# EAGLE design Current Driver v2 (EAGLE 9.6.2)
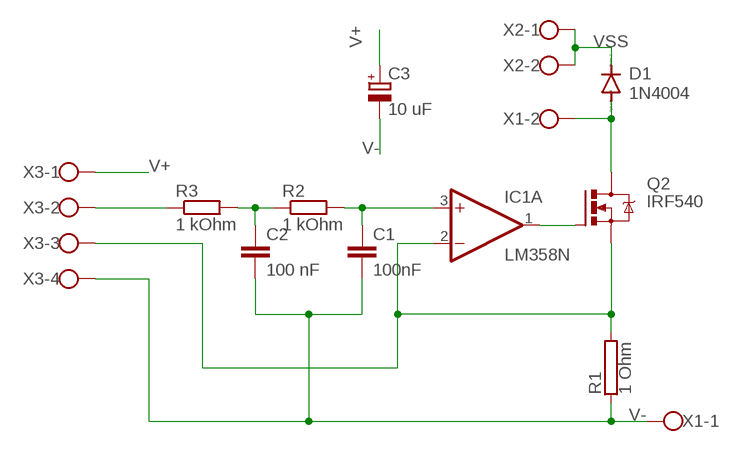
[diagram p0: schematic, sheet 1]

## Parts
C1  100nF  C-EU050-030X075  [C050-030X075]
C2  100 nF  C-EU050-030X075  [C050-030X075]
C3  10 uF  CPOL-EUE2,5-6E  [E2,5-6E]
D1  1N4004  [DO41-10]
IC1  LM358N  [DIL08]
Q2  IRF540  [TO220BV]
R1  1 Ohm  RAC05  [AC05]
R2  1 kOhm  R-EU_0204/7  [0204/7]
R3  1 kOhm  R-EU_0204/7  [0204/7]
X1  W237-102  [W237-102]
X2  W237-102  [W237-102]
X3  W237-4  [W237-4]

## Nets
N$1: IC1.1(A:OUT) Q2.G
N$2: D1.A Q2.D X1.2
N$4: C2.1 R2.1 R3.2
N$5: C1.1 IC1.3(A:+IN) R2.2
N$6: R3.1 X3.2
N$7: IC1.2(A:-IN) Q2.S R1.2 X3.3
V+: C3.+ X3.1
V-: C1.2 C2.2 C3.- R1.1 X1.1 X3.4
VSS: D1.C X2.1 X2.2
Unconnected: IC1.5(B:+IN) IC1.6(B:-IN) IC1.7(B:OUT)

## Power pins joined to a net without a drawn wire
V+: IC1.8(P:V+)
V-: IC1.4(P:V-)

## Library data of the parts
C1 C2 = rcl:C-EU: CAPACITOR, European symbol; SPICEPREFIX: C
C3 = rcl:CPOL-EU: POLARIZED CAPACITOR, European symbol; SPICEPREFIX: C
D1 = diode:1N4004: DIODE general purpose rectifier, 1 A
IC1 = linear:LM358: OP AMP also LM158; LM258; LM2904 Source: http://cache.national.com/ds/LM/LM158.pdf
Q2 = transistor-power:IRF540: HEXFET Power MOSFET
R1 = resistor-power:R: Power Resitor; OC_FARNELL: unknown; OC_NEWARK: unknown
R2 R3 = rcl:R-EU_: RESISTOR, European symbol; SPICEPREFIX: R
X1 X2 = con-wago-500:W237-102: WAGO SCREW CLAMP; MPN: 237-102; OC_FARNELL: unknown; OC_NEWARK: 70K9898
X3 = con-wago-500:W237-4: WAGO SCREW CLAMP; OC_FARNELL: unknown; OC_NEWARK: unknown

## Board
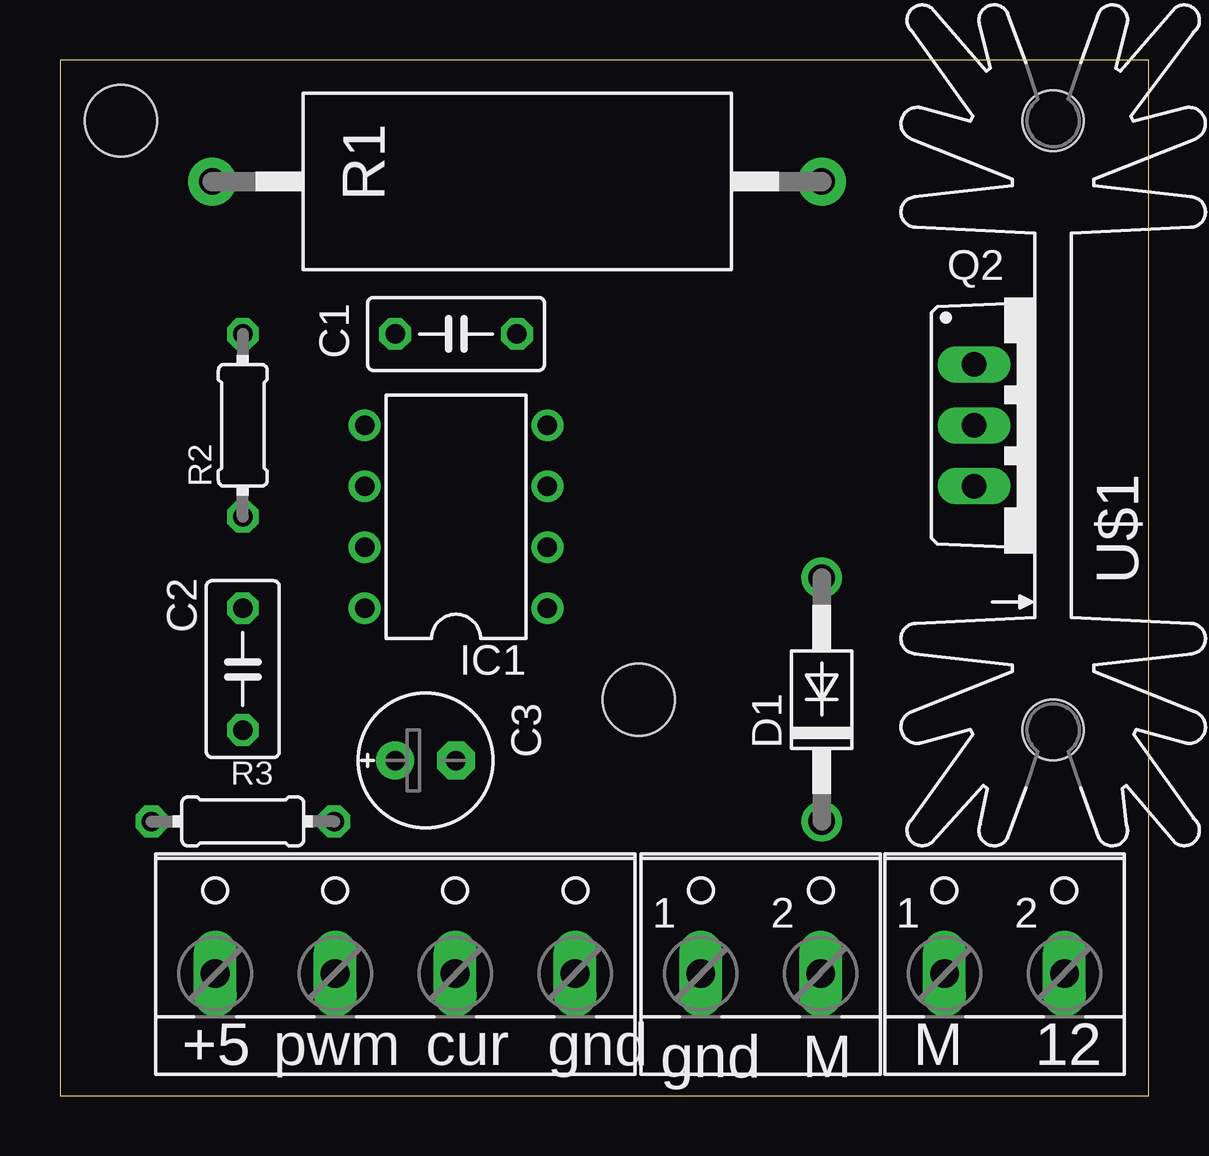
[diagram p1: board, top side]
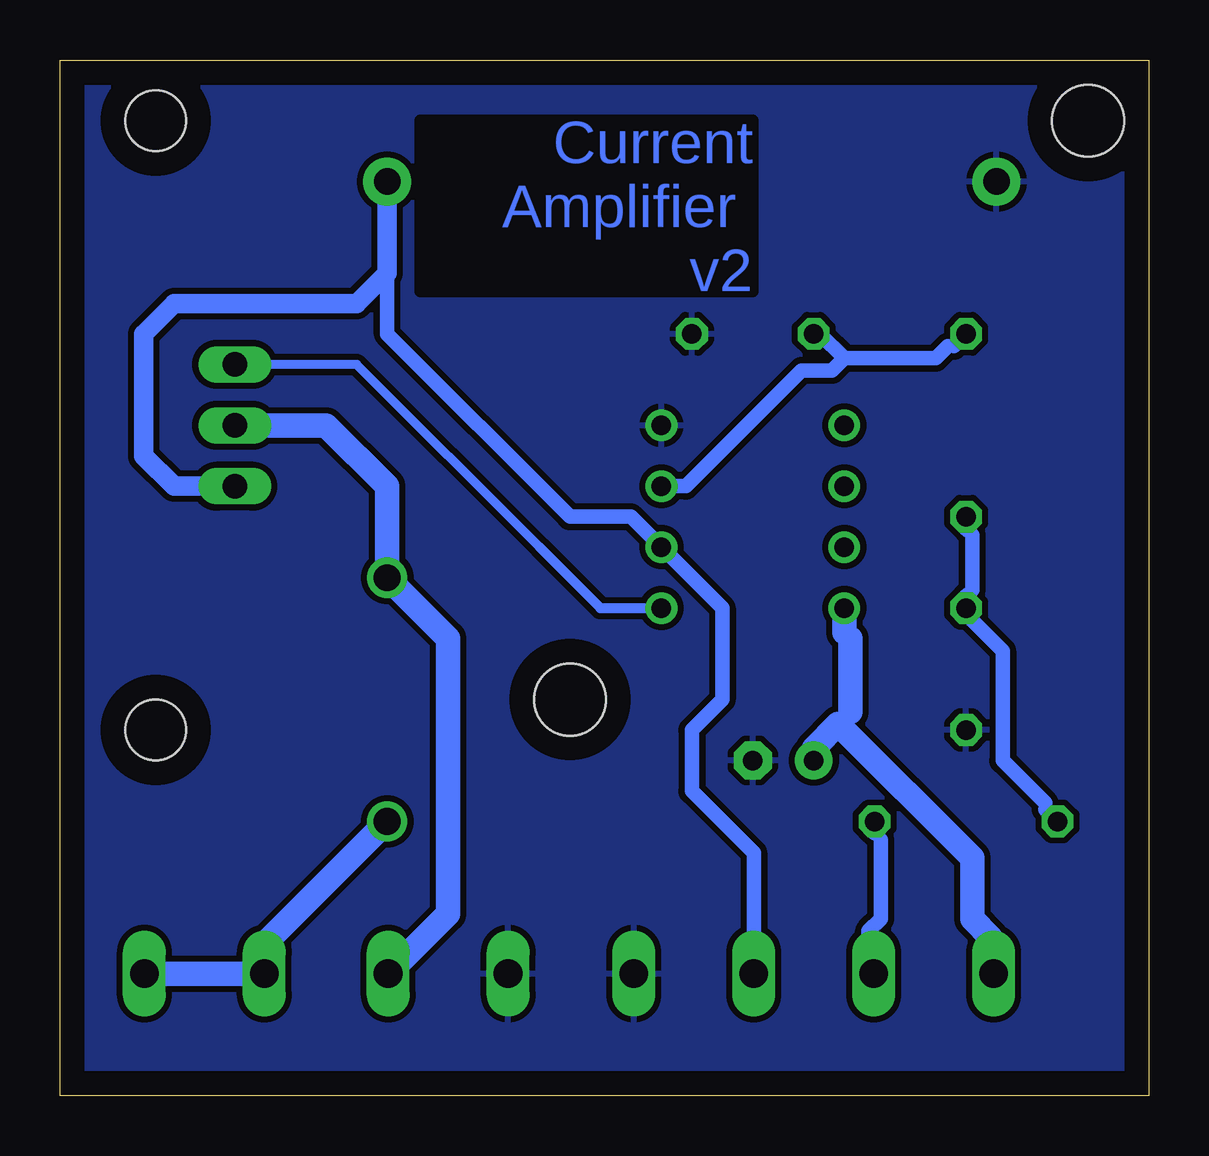
[diagram p2: board, bottom side, seen from below]

Size 45.39 x 43.17 mm. Coordinates in mm from the lower left corner, seen from the top.
Outline: 0,0 45.39,0 45.39,43.17 0,43.17 0,0
Copper layers (1*16): Top 0.035mm / dielectric 1.5mm / Bottom 0.035mm
Design rules "default *": minimum track width 10mil, minimum drill 0.35mm, track to track 10mil, track to pad 10mil, pad to pad 10mil, via to via 10mil, smd to smd 6mil, copper to edge 40mil, drill to drill 6mil, minimum pad ring 10mil, minimum via ring 8mil, stop-mask expansion 4mil, vias tented up to drill 0mil, thermal gap 10mil
Holes 3 mm at 2.54,40.64 24.13,16.51

### Footprints (pad centres in the part's own frame; a part is rotated, then mirrored left to right if it is on the bottom)
C050-030X075 = drill 0.813 octagon: 1 -2.54,0; 2 2.54,0
E2,5-6E = drill 0.813 pad 1.575: + -1.27,0 | drill 0.813 pad 1.575 octagon: - 1.27,0
DO41-10 = drill 1.118: A 5.08,0; C -5.08,0
DIL08 = drill 0.813 pad 1.27: 1 -3.81,-3.81; 2 -1.27,-3.81; 3 1.27,-3.81; 4 3.81,-3.81; 5 3.81,3.81; 6 1.27,3.81; 7 -1.27,3.81; 8 -3.81,3.81
TO220BV = drill 1.016 long: D 0,-2.54; G -2.54,-2.54; S 2.54,-2.54
AC05 = drill 1.1 pad 2: 1 -12.7,0; 2 12.7,0
0204/7 = drill 0.813 octagon: 1 -3.81,0; 2 3.81,0
SK104 = hole 2.54: -12.7,-0.762; 12.7,-0.762
W237-102 = drill 1.194 long: 1 -2.5,-1.27; 2 2.5,-1.27
W237-4 = drill 1.194 long: 1 -7.5,-1.27; 2 -2.5,-1.27; 3 2.5,-1.27; 4 7.5,-1.27

### Placement (x,y rotation side)
C1  16.51,31.75 0 top
C2  7.62,17.78 270 top
C3  15.24,13.97 0 top
D1  31.75,16.51 90 top
IC1  16.51,24.13 90 top
Q2  40.64,27.94 270 top
R1  19.05,38.1 0 top
R2  7.62,27.94 90 top
R3  7.62,11.43 180 top
U$1  [SK104]  40.64,27.94 90 top
X1  29.21,6.35 0 top
X2  39.37,6.35 0 top
X3  13.97,6.35 0 top

### Tracks (layer width: path | path; a pad name or v marks a point on that pad's centre or on a via)
N$1
  Bottom 0.381: Q2.G 33.02,30.48 25.4,22.86
  Bottom 0.406: 25.4,22.86 22.86,20.32 IC1.1
N$2
  Bottom 1.016: Q2.D 34.29,27.94 31.75,25.4 D1.A 29.21,19.05 29.21,7.58 X1.2
N$4
  Bottom 0.254: C2.1 7.62,20.07
  Bottom 0.381: 4.32,12.19 4.32,11.94
  Bottom 0.61: 4.32,11.94 R3.2 | 4.32,12.19 6.1,13.97 6.1,18.54 7.62,20.07 | R2.1 7.62,23.62 7.37,23.37 7.37,21.08 7.62,20.83 C2.1
N$5
  Bottom 0.254: 8.38,31.24 8.13,31.24
  Bottom 0.61: 8.13,31.24 R2.2 | 8.38,31.24 8.89,30.73 12.7,30.73 | 12.7,30.73 13.72,31.75 C1.1 | IC1.3 19.3,25.4 14.48,30.23 13.21,30.23 12.7,30.73
N$6
  Bottom 0.381: 11.18,10.67 11.43,10.92
  Bottom 0.61: 11.43,10.92 R3.1 | 11.18,10.67 11.18,7.37 11.68,6.86 11.68,5.08 X3.2
N$7
  Bottom 0.61: 31.75,34.29 31.75,31.75 24.13,24.13 21.59,24.13 IC1.2 17.78,20.32 17.78,16.51 19.05,15.24 19.05,12.7 16.47,10.12 X3.3
  Bottom 0.813: R1.2 31.75,34.29 33.02,33.02 40.64,33.02 41.91,31.75 41.91,26.67 40.64,25.4 Q2.S
V+
  Bottom 0.381: 12.45,19.05 12.7,19.3
  Bottom 0.61: 12.95,15.49 12.45,16 | 6.6,5.08 X3.1
  Bottom 1.016: 12.7,19.3 IC1.8 | 12.45,16 12.45,19.05 | C3.+ 13.97,14.48 12.95,15.49 7.37,9.91 7.37,7.37 6.6,6.6 6.6,5.08
V-
  pour Bottom: 0,43.18 45.72,43.18 45.72,0 0,0
VSS
  Bottom 1.016: X2.2 X2.1 36.87,6.31 D1.C

### Text on the board
Bottom: Current / Amplifier / v2
tPlace: gnd | M | +5 | pwm | cur | gnd | M | 12